# EAGLE design midi (EAGLE 7.2.0)
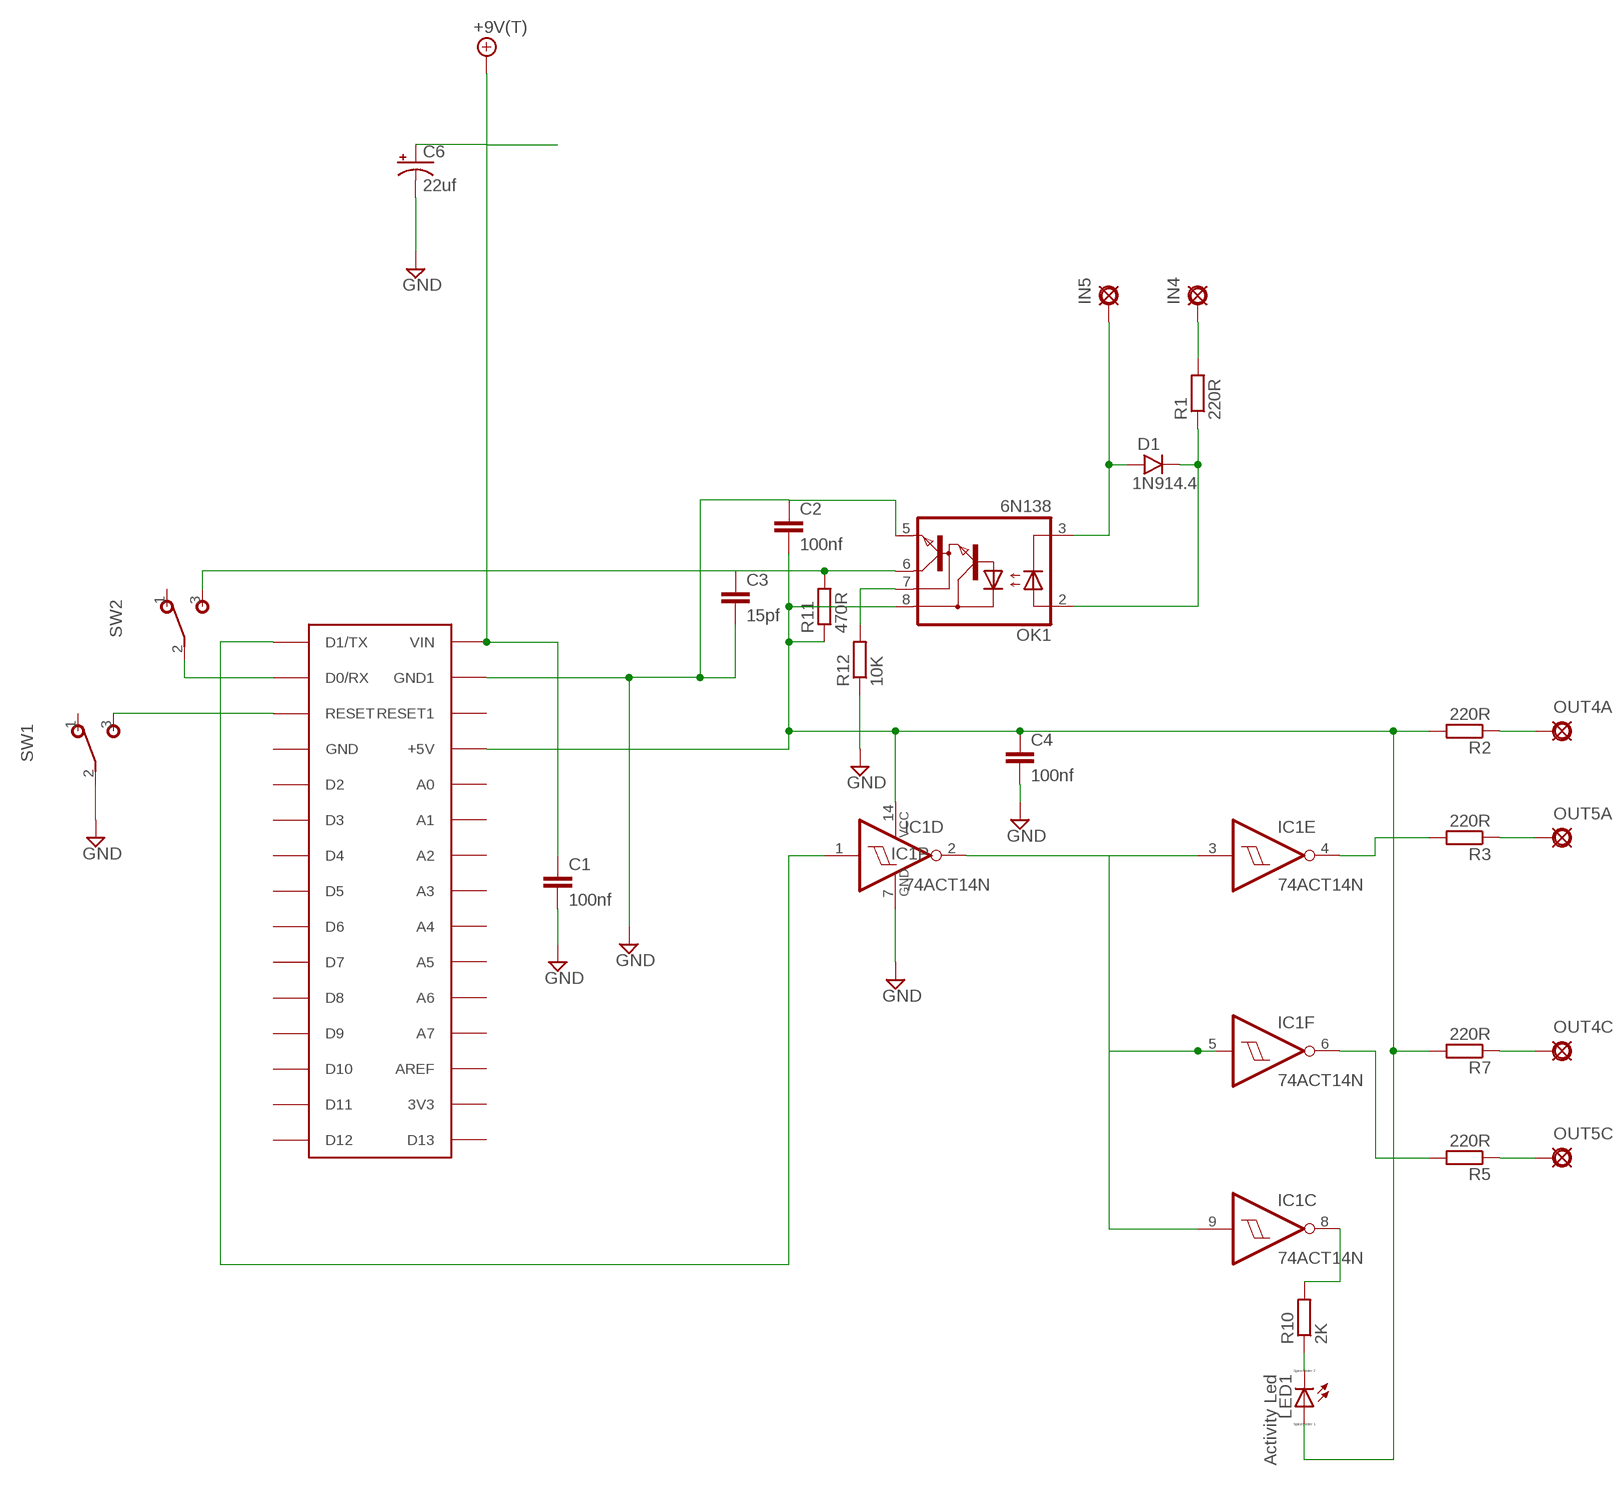
[diagram p0: schematic, sheet 1]

## Parts
+9V1  +9V(T)  [SQUARE]
C1  100nf  C5/2.5  [C5B2.5]
C2  100nf  C5/2.5  [C5B2.5]
C3  15pf  050X030_0251  [050X030_025]
C4  100nf  C5/2.5  [C5B2.5]
C6  22uf  0501  [050_020_1]
D1  1N914.4  [DO35-4]
IC1  74ACT14N  [DIL14]
IN4  PAD8  [OCTOGON]
IN5  PAD8  [OCTOGON]
LED1  Activity Led  LED_E  [LED_1206]
OK1  6N138  [DIL08]
OUT4A  PAD8  [OCTOGON]
OUT4C  PAD8  [OCTOGON]
OUT5A  PAD8  [OCTOGON]
OUT5C  PAD8  [OCTOGON]
R1  220R  R-EU_0204/7  [0204/7]
R2  220R  R-EU_0204/7  [0204/7]
R3  220R  R-EU_0204/7  [0204/7]
R5  220R  R-EU_0204/7  [0204/7]
R7  220R  R-EU_0204/7  [0204/7]
R10  2K  R-EU_0204/7  [0204/7]
R11  470R  R-EU_0204/7  [0204/7]
R12  10K  R-EU_0204/7  [0204/7]
SW1  SPDT  [M9040P]
SW2  SPDT  [M9040P]
U$1  ARDUINONANO  [PDIP-32]

## Nets
+9V: +9V1.1(+9V) C1.1 C6.+ U$1.VIN
GND: C1.2 C2.1 C3.2 C4.2 C6.- IC1.7(P:GND) OK1.5(GND) R12.1 SW1.2(P) U$1.GND1
N$1: D1.C OK1.2(A) R1.1
N$2: IN4.1(PAD) R1.2
N$3: D1.A IN5.1(PAD) OK1.3(C)
N$4: C2.2 C4.1 IC1.14(P:VCC) LED1.A OK1.8(VCC) R2.2 R7.2 R11.1 U$1.+5V
N$5: OK1.7(VB) R12.2
N$6: C3.1 OK1.6(VO) R11.2 SW2.3(S)
N$7: IC1.1(D:I) U$1.D1/TX
N$8: IC1.2(D:O) IC1.3(E:I) IC1.5(F:I) IC1.9(C:I)
N$9: OUT4A.1(PAD) R2.1
N$10: OUT5A.1(PAD) R3.1
N$12: OUT5C.1(PAD) R5.1
N$14: OUT4C.1(PAD) R7.1
N$17: IC1.4(E:O) R3.2
N$19: IC1.6(F:O) R5.2
N$21: IC1.8(C:O) R10.2
N$22: LED1.C R10.1
N$23: SW1.3(S) U$1.RESET
N$24: SW2.2(P) U$1.D0/RX
Unconnected: IC1.10(B:O) IC1.11(B:I) IC1.12(A:O) IC1.13(A:I) SW1.1(O) SW2.1(O) U$1.3V3 U$1.A0 U$1.A1 U$1.A2 U$1.A3 U$1.A4 U$1.A5 U$1.A6 U$1.A7 U$1.AREF U$1.D2 U$1.D3 U$1.D4 U$1.D5 U$1.D6 U$1.D7 U$1.D8 U$1.D9 U$1.D10 U$1.D11 U$1.D12 U$1.D13 U$1.GND U$1.RESET1

## Library data of the parts
+9V1 = gm-supply:+9V(T): +9V Voltage Supply use this to hook up +9v throughout a schematic instead of running wire automatically labels the net "+9v" adds a hookup pad to the circuit board
C1 C2 C4 = capacitor-wima:C: CAPACITOR naming: grid - package width
C3 = gm-caps-ceramic:050X030_025: 47 - 120pF Xicon Ceramic Disc 2.5mm lead spacing
C6 = gm-caps-electro-pol:050: 0.22 - 100uF Xicon values at Mouser.com: 10V: 10 - 100uF; 16V: 2.2 - 47uF; 25V: 0.47 - 47uF; 50V: 0.22 - 22uF
D1 = gm-diodes:1N914: Fast Switching Diode DO-35 glass case a.k.a. 1N4148
IC1 = 74xx-eu:74*14: Hex schmitt trigger INVERTER
IN4 IN5 OUT4A OUT4C OUT5A OUT5C = gm-supply:PAD: PAD use this package for pads with any purpose, including input, output, send or return various pad shapes: round, square, octogonal, long, and long offset
LED1 = eagle-ltspice:LED_E: LED Source: http://www.osram.convergy.de Source: www.luxeon.com Source: www.kingbright.com; SPICEMODEL: NONE; SPICEPREFIX: D; SPICETYPE: diode
OK1 = optocoupler:6N138: MOTOROLA OPTO COUPLER; MF: VISHAY/TELEFUNKEN; MPN: 6N138; OC_FARNELL: 9860150; OC_NEWARK: 35K5294
R1-R3 R5 R7 R10-R12 = rcl:R-EU_: RESISTOR, European symbol
SW1 SW2 = gm-switches:SPDT: TOGGLE SWITCH Marquardt
U$1 = jet-lib:ARDUINONANO

## Board
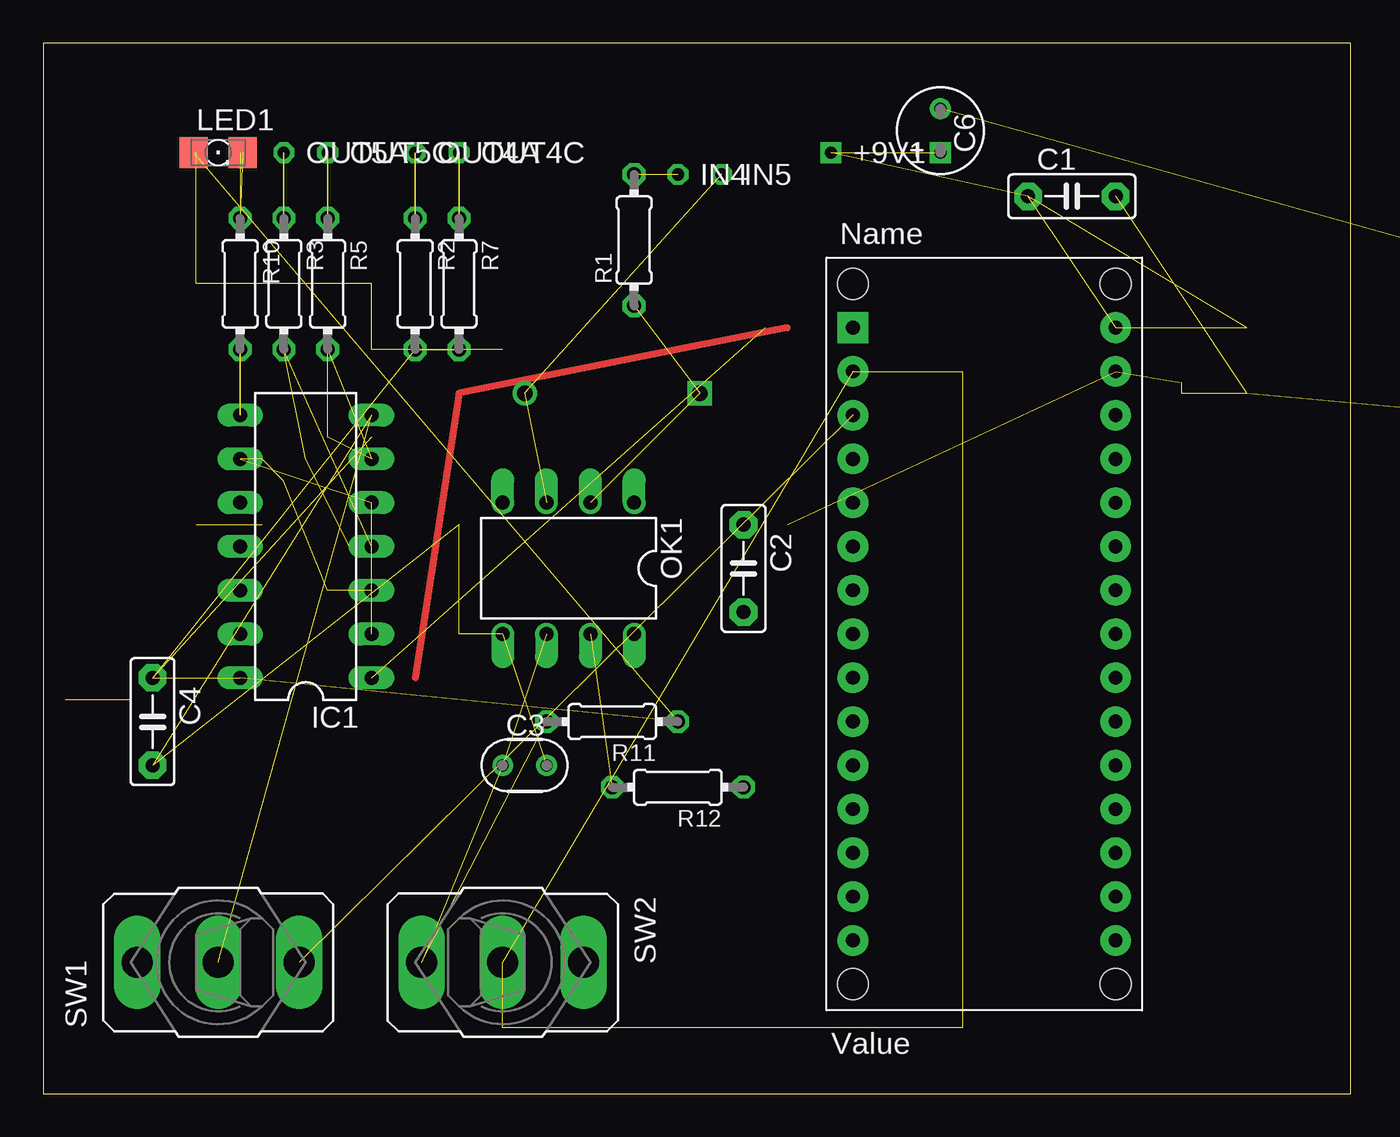
[diagram p1: board, top side]
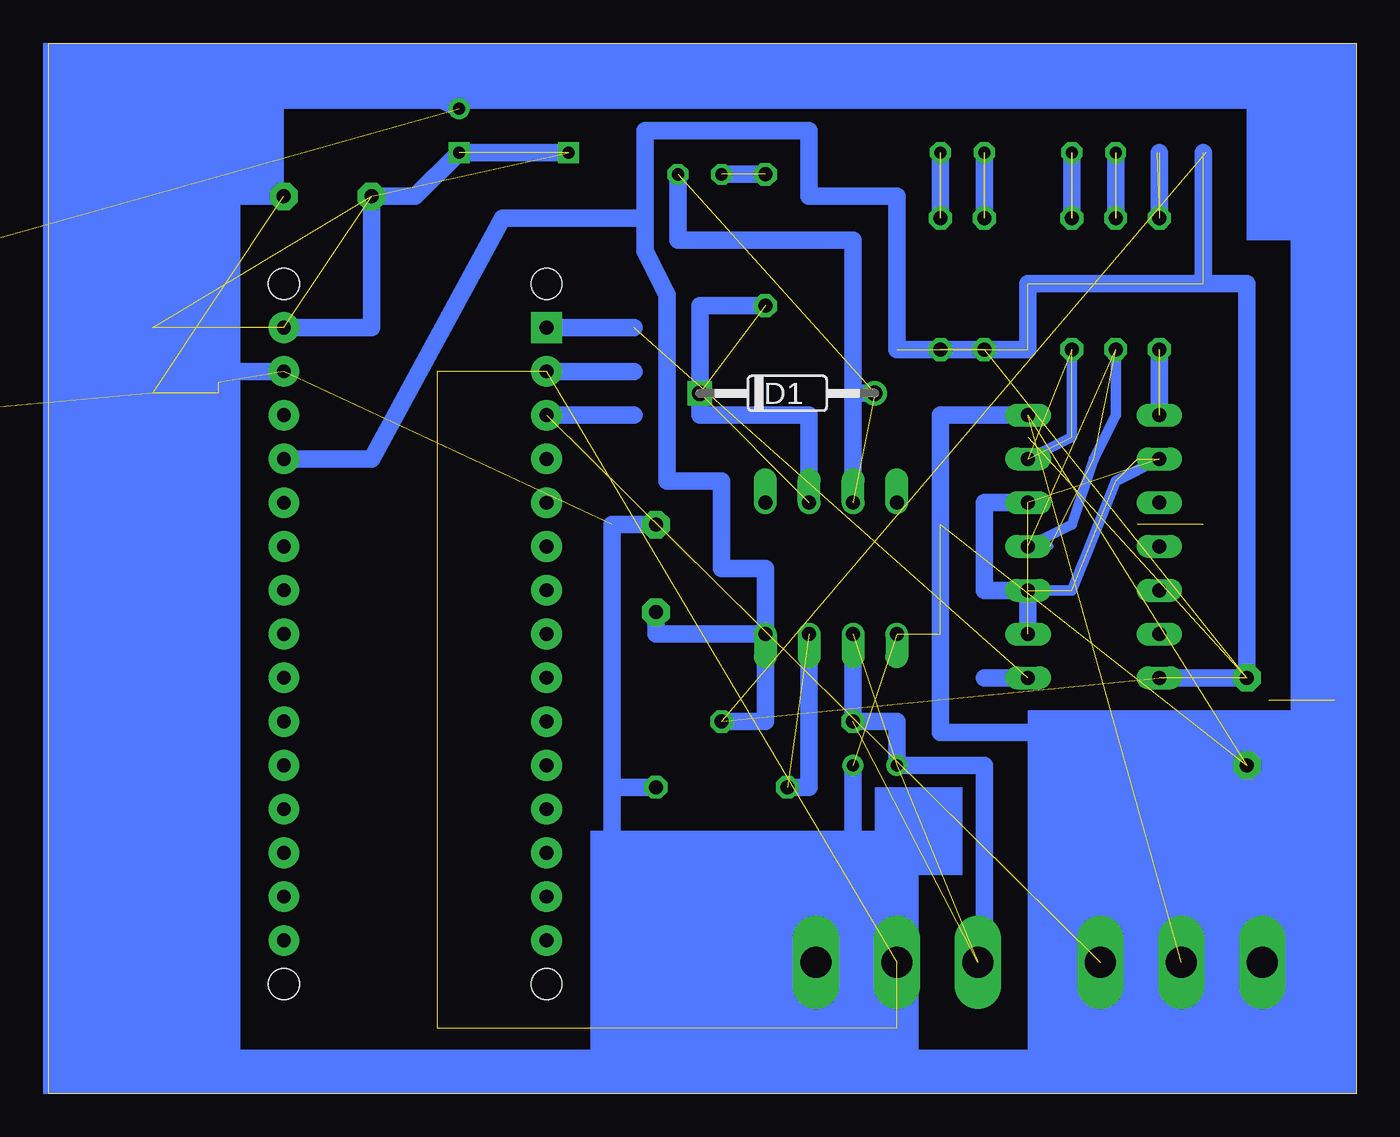
[diagram p2: board, bottom side, seen from below]

Size 75.87 x 60.95 mm. Coordinates in mm from the lower left corner, seen from the top.
Outline: 0,0 75.87,0 75.87,60.95 0,60.95 0,0
Copper layers (1*16): Top 0.035mm / dielectric 1.5mm / Bottom 0.035mm
Design rules "default": minimum track width 10mil, minimum drill 24mil, track to track 8mil, track to pad 8mil, pad to pad 8mil, via to via 8mil, smd to smd 8mil, copper to edge 40mil, drill to drill 8mil, minimum pad ring 10mil, minimum via ring 8mil, stop-mask expansion 4mil, vias tented up to drill 0mil, thermal gap 10mil

### Footprints (pad centres in the part's own frame; a part is rotated, then mirrored left to right if it is on the bottom)
SQUARE = drill 0.7 square: 1 0,0
C5B2.5 = drill 0.813 pad 1.6 octagon: 1 -2.54,0; 2 2.54,0
050X030_025 = drill 0.7: 1 -1.27,0; 2 1.27,0
050_020_1 = drill 0.7 square: + -1.27,0 | drill 0.7: - 1.27,0
DO35-4 = drill 0.9 pad 1.422: A 5.08,0 | drill 0.9 pad 1.422 square: C -5.08,0
DIL14 = drill 0.813 long: 1 -7.62,-3.81; 2 -5.08,-3.81; 3 -2.54,-3.81; 4 0,-3.81; 5 2.54,-3.81; 6 5.08,-3.81; 7 7.62,-3.81; 8 7.62,3.81; 9 5.08,3.81; 10 2.54,3.81; 11 0,3.81; 12 -2.54,3.81; 13 -5.08,3.81; 14 -7.62,3.81
OCTOGON = drill 0.7 octagon: 1 0,0
LED_1206 = smd 1.6 x 1.803: A -1.422,0; C 1.422,0
DIL08 = drill 0.813 offset: 1 -3.81,-3.81; 2 -1.27,-3.81; 3 1.27,-3.81; 4 3.81,-3.81; 5 3.81,3.81; 6 1.27,3.81; 7 -1.27,3.81; 8 -3.81,3.81
0204/7 = drill 0.813 octagon: 1 -3.81,0; 2 3.81,0
M9040P = drill 1.803 long: 1 0,4.699; 2 0,0; 3 0,-4.699
PDIP-32 = drill 0.8 pad 1.778: 3V3 15.24,-35.56; +5V 15.24,-10.16; A0 15.24,-12.7; A1 15.24,-15.24; A2 15.24,-17.78; A3 15.24,-20.32; A4 15.24,-22.86; A5 15.24,-25.4; A6 15.24,-27.94; A7 15.24,-30.48; AREF 15.24,-33.02; D0/RX 0,-5.08; D2 0,-12.7; D3 0,-15.24; D4 0,-17.78; D5 0,-20.32; D6 0,-22.86; D7 0,-25.4; D8 0,-27.94; D9 0,-30.48; D10 0,-33.02; D11 0,-35.56; D12 0,-38.1; D13 15.24,-38.1; GND 0,-10.16; GND1 15.24,-5.08; RESET 0,-7.62; RESET1 15.24,-7.62; VIN 15.24,-2.54 | drill 0.8 pad 1.778 square: D1/TX 0,-2.54 | hole 1.778: 0,0; 0,-40.64; 15.24,-40.64; 15.24,0

### Placement (x,y rotation side)
+9V1  45.72,54.61 0 top
C1  59.69,52.07 0 top
C2  40.64,30.48 270 top
C3  27.94,19.05 0 top
C4  6.35,21.59 270 top
C6  52.07,55.88 90 top
D1  33.02,40.64 0 bottom
IC1  15.24,31.75 90 top
IN4  36.83,53.34 0 top
IN5  39.37,53.34 0 top
LED1  10.16,54.61 0 top
OK1  30.48,30.48 180 top
OUT4A  21.59,54.61 0 top
OUT4C  24.13,54.61 0 top
OUT5A  13.97,54.61 0 top
OUT5C  16.51,54.61 0 top
R1  34.29,49.53 90 top
R2  21.59,46.99 270 top
R3  13.97,46.99 270 top
R5  16.51,46.99 270 top
R7  24.13,46.99 270 top
R10  11.43,46.99 270 top
R11  33.02,21.59 180 top
R12  36.83,17.78 180 top
SW1  10.16,7.62 90 top
SW2  26.67,7.62 270 top
U$1  46.99,46.99 0 top

### Tracks (layer width: path | path; a pad name or v marks a point on that pad's centre or on a via)
+9V  (5 unrouted)
  Bottom 1.016: +9V1.1 C6.+ 54.61,52.07 C1.1 57.15,44.45 U$1.VIN
GND  (14 unrouted)
  Bottom 0.406: 2.54,19.05 1.27,19.05
  Bottom 1.016: C2.1 43.18,33.02 43.18,17.78 | 43.18,17.78 R12.1 | 43.18,17.78 43.18,13.97 29.21,13.97 C3.2 | 2.54,19.05 C4.2 15.24,19.05 17.78,20.95 24.13,20.95 24.13,39.37 IC1.7 | C6.- 54.61,58.42 | U$1.GND1 74.93,41.91 | C1.2 64.77,52.07
N$1  (2 unrouted)
  Bottom 1.016: R1.1 38.1,45.72 D1.C 38.1,39.37 31.75,39.37 OK1.2
N$2  (1 unrouted)
  Bottom 1.016: IN4.1 R1.2
N$3  (2 unrouted)
  Bottom 1.016: IN5.1 39.37,49.53 29.21,49.53 29.21,45.72 29.21,40.64 | 29.21,40.64 D1.A 29.21,40.64 | 29.21,40.64 29.21,38.1 OK1.3
N$4  (13 unrouted)
  Bottom 1.016: OK1.8 40.64,26.67 C2.2 | OK1.8 34.29,30.48 36.83,30.48 36.83,35.56 40.01,35.56 40.01,46.35 41.27,48.9 41.27,50.8 | 41.27,50.8 49.53,50.8 57.15,36.83 U$1.+5V | 41.27,50.8 41.27,55.88 31.75,55.88 31.75,52.07 26.67,52.07 26.67,43.18 R7.2 R2.2 19.05,43.18 19.05,46.99 8.89,46.99 | 8.89,46.99 8.89,54.61 | 8.89,46.99 6.35,46.99 C4.1 IC1.14 | R11.1 34.29,21.59 OK1.8
N$5  (1 unrouted)
  Bottom 1.016: OK1.7 31.75,17.78 R12.2
N$6  (3 unrouted)
  Bottom 1.016: OK1.6 R11.2 26.67,21.59 C3.1 21.59,19.05 21.59,7.62
N$7  (1 unrouted)
  Bottom 1.016: U$1.D1/TX 41.91,44.45 | 21.59,24.13 IC1.1
N$8  (7 unrouted)
  Bottom 0.61: IC1.9 13.97,35.56 16.51,29.21 IC1.3
  Bottom 1.016: IC1.2 IC1.3 21.59,29.21 21.59,34.29 IC1.5
N$9  (2 unrouted)
  Bottom 1.016: R2.1 OUT4A.1
N$10  (2 unrouted)
  Bottom 1.016: R3.1 OUT5A.1
N$12  (2 unrouted)
  Bottom 1.016: R5.1 OUT5C.1
N$14  (2 unrouted)
  Bottom 1.016: R7.1 OUT4C.1
N$17  (3 unrouted)
  Bottom 0.406: IC1.4 17.78,31.75
  Bottom 0.61: R3.2 13.97,39.37 15.24,36.83 16.51,33.02 IC1.4
N$19  (3 unrouted)
  Bottom 0.61: IC1.6 16.51,38.1 R5.2
N$21  (2 unrouted)
  Bottom 1.016: IC1.8 R10.2
N$22  (2 unrouted)
  Bottom 1.016: 11.43,54.61 R10.1
N$23  (1 unrouted)
  Bottom 1.016: U$1.RESET 41.91,39.37
N$24  (5 unrouted)
  Bottom 1.016: U$1.D0/RX 41.91,41.91
N$25  (1 unrouted)
N$26
  Top 0.406: 43.18,44.45 24.13,40.64 21.59,24.13
N$27  (1 unrouted)
(copper drawn outside any net)
  shapes: Bottom area x20